# EAGLE design TB67S109ATFG Board 3x - with 40mm fans - Grbl (EAGLE 9.0.0)
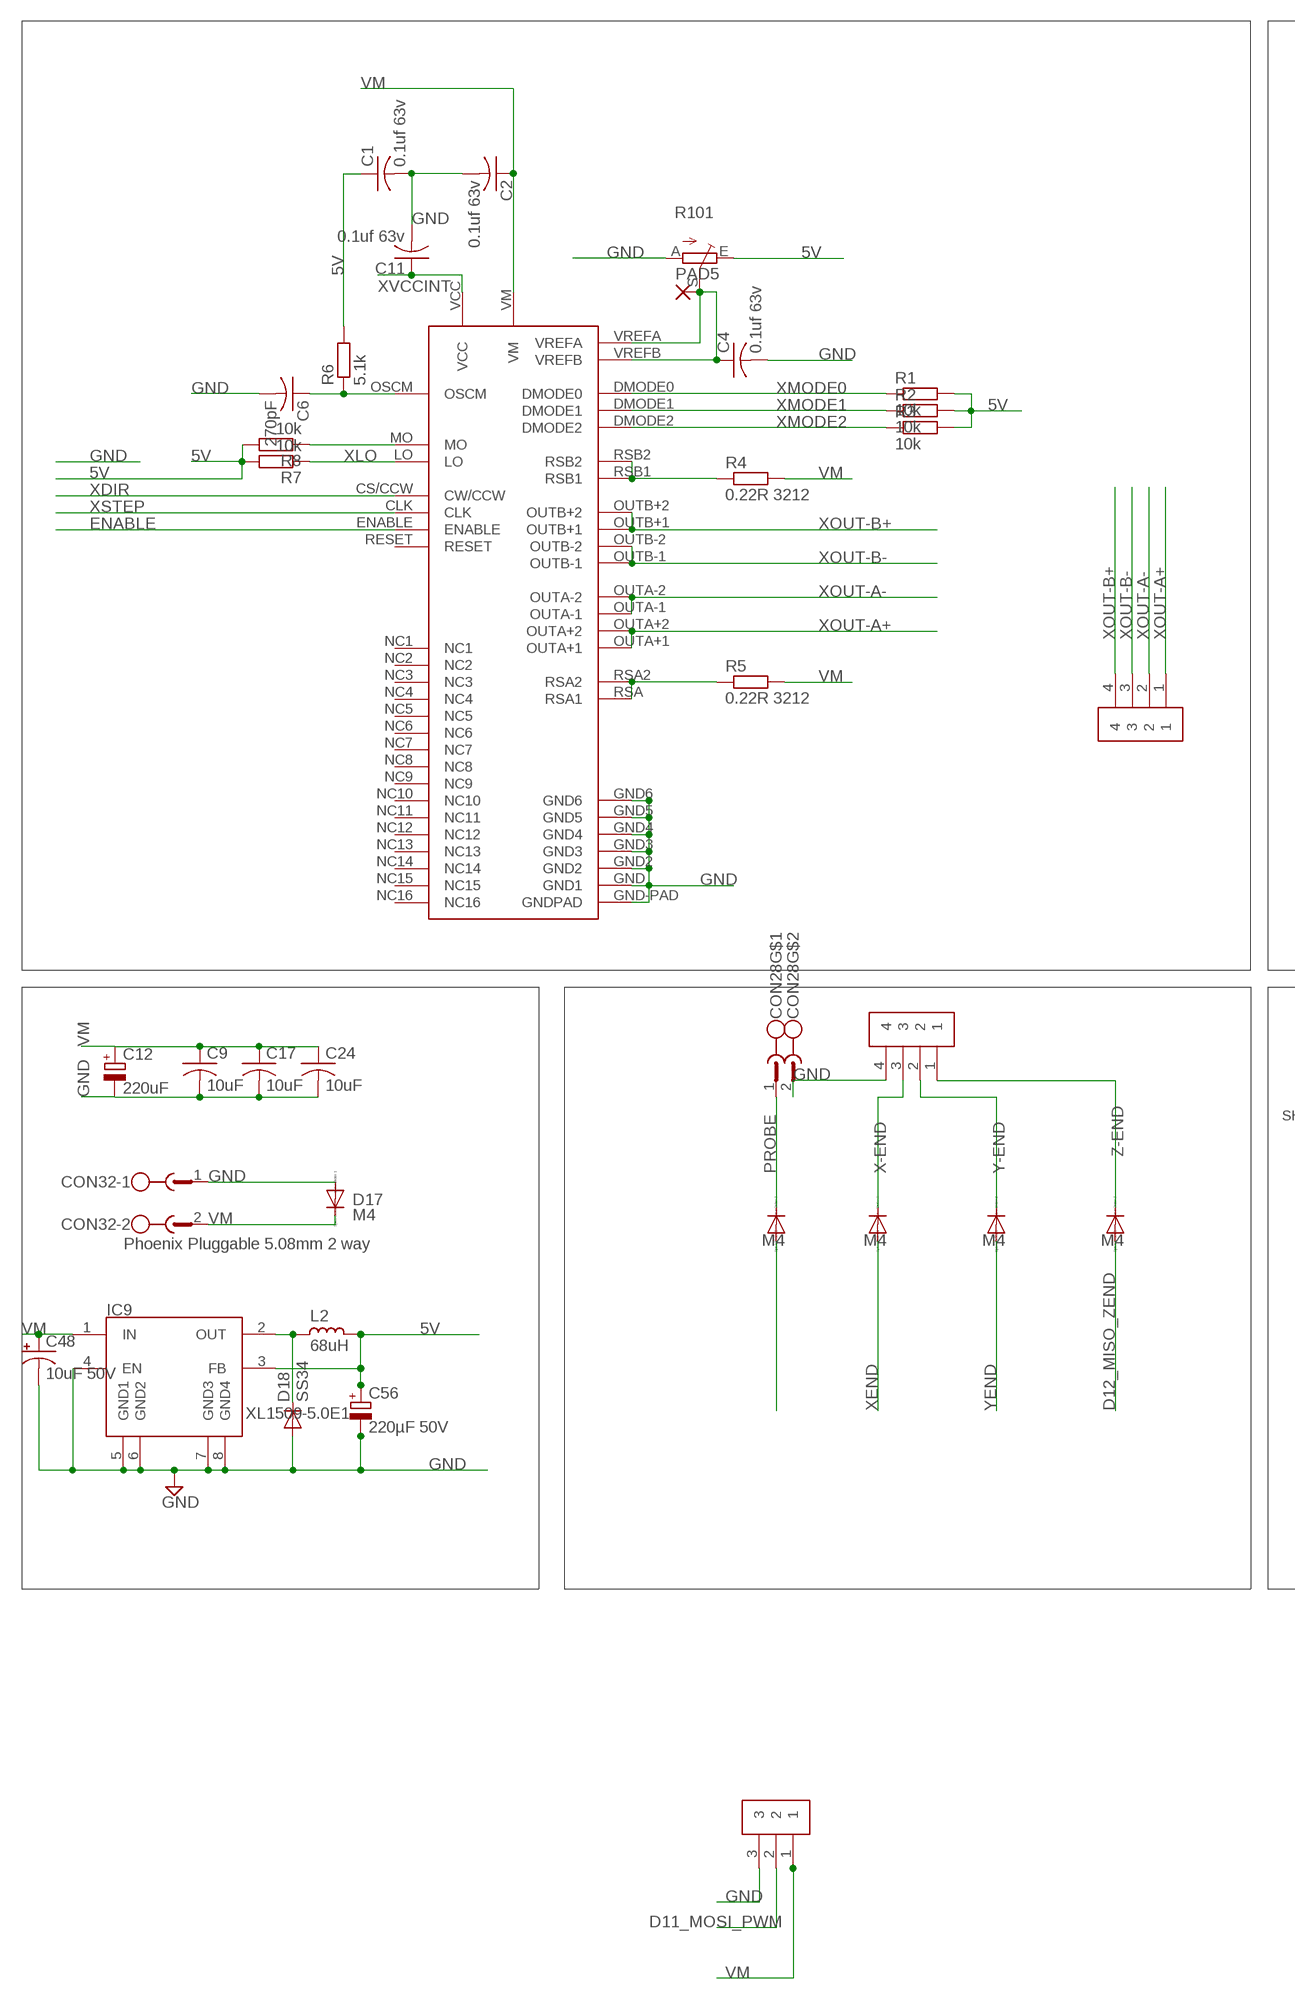
[diagram p0: schematic, sheet 1, part 1 of 2]
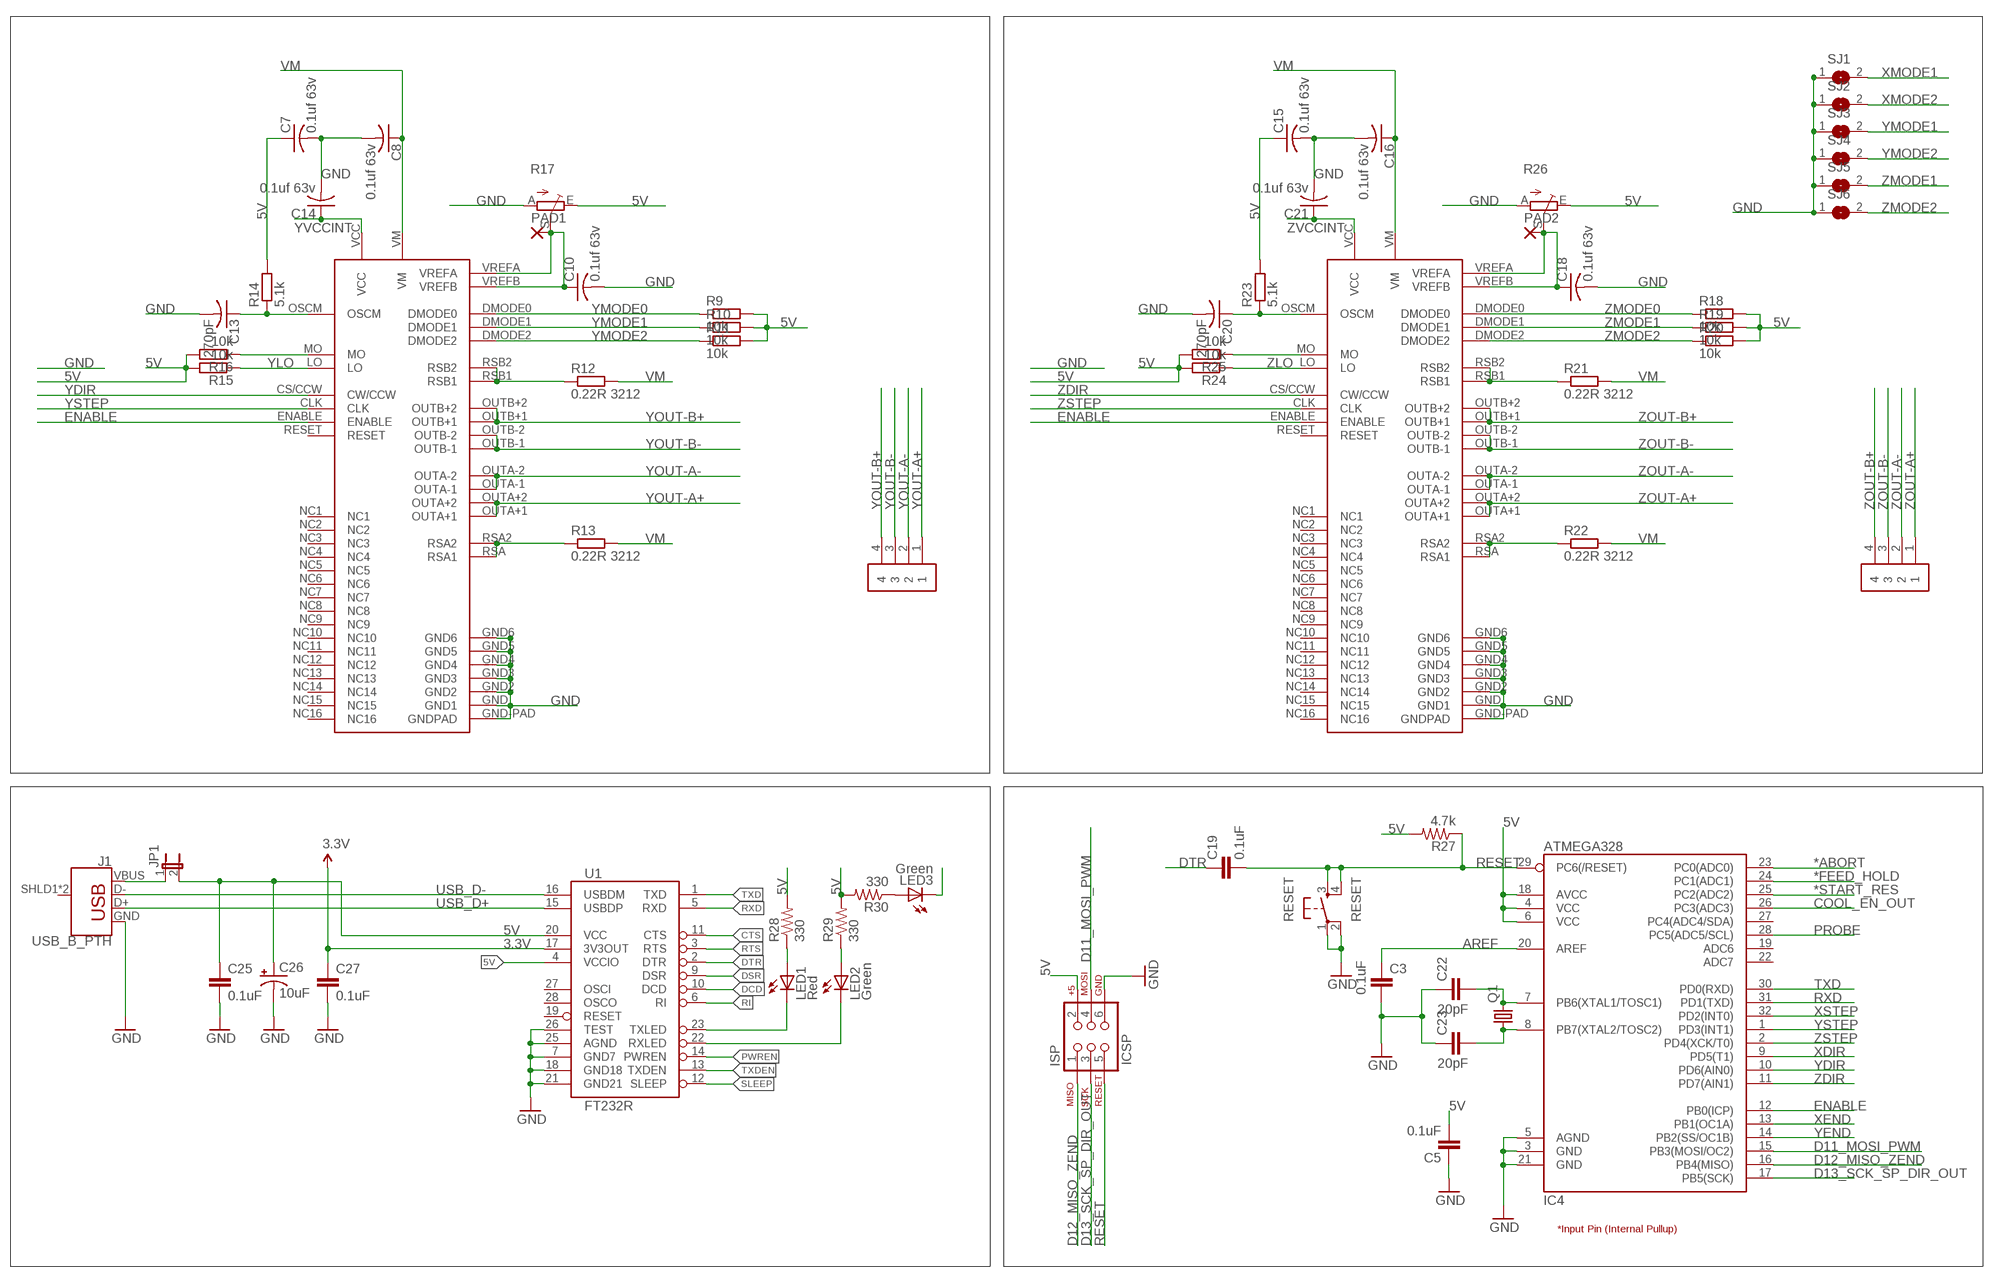
[diagram p1: schematic, sheet 1, part 2 of 2]

## Parts
C1  0.1uf 63v  C-USC0603K  [C0603K]
C2  0.1uf 63v  C-USC0603K  [C0603K]
C3  0.1uF  CAP0603-CAP  [0603-CAP]
C4  0.1uf 63v  C-USC0603K  [C0603K]
C5  0.1uF  CAP0603-CAP  [0603-CAP]
C6  270pF  C-USC0603K  [C0603K]
C7  0.1uf 63v  C-USC0603K  [C0603K]
C8  0.1uf 63v  C-USC0603K  [C0603K]
C9  10uF  C-USC1206K  [C1206K]
C10  0.1uf 63v  C-USC0603K  [C0603K]
C11  0.1uf 63v  C-USC0603K  [C0603K]
C12  220uF  CPOL-EUE3.5-8  [E3,5-8]
C13  270pF  C-USC0603K  [C0603K]
C14  0.1uf 63v  C-USC0603K  [C0603K]
C15  0.1uf 63v  C-USC0603K  [C0603K]
C16  0.1uf 63v  C-USC0603K  [C0603K]
C17  10uF  C-USC1206K  [C1206K]
C18  0.1uf 63v  C-USC0603K  [C0603K]
C19  0.1uF  CAP0603-CAP  [0603-CAP]
C20  270pF  C-USC0603K  [C0603K]
C21  0.1uf 63v  C-USC0603K  [C0603K]
C22  20pF  CAP1206  [1206]
C23  20pF  CAP1206  [1206]
C24  10uF  C-USC1206K  [C1206K]
C25  0.1uF  0.1UF-25V(+80/-20%)(0603)  [0603-CAP]
C26  10uF  10UF-16V-10%(TANT)  [EIA3216]
C27  0.1uF  0.1UF-25V(+80/-20%)(0603)  [0603-CAP]
C48  10uF 50V  CAP_POL1206  [EIA3216]
C56  220µF 50V  CPOL-EUE3.5-8  [E3,5-8]
CON17  Phoenix Pluggable 3.81mm 3 way  CONNECTOR-M3  [3.81MM-3WAY-PLUGGABLE-SCREW]
CON28  Phoenix Pluggable 3.81mm 2 way  MC1.5/2  [MC1.5/2-G-3.81]
CON32  Phoenix Pluggable 5.08mm 2 way  MSTBA2  [MSTBA2]
D2  M4  DIODE-DO-214AC  [DO-214AC]
D14  M4  DIODE-DO-214AC  [DO-214AC]
D15  M4  DIODE-DO-214AC  [DO-214AC]
D16  M4  DIODE-DO-214AC  [DO-214AC]
D17  M4  DIODE-DO-214AC  [DO-214AC]
D18  SS34  DIODE-DO-214AC  [DO-214AC]
IC4  ATMEGA328  ATMEGA168  [TQFP32-08]
IC9  XL1509-5.0E1  XL1509  [SO08]
ISP  ICSP  AVR_SPI_PRG_6PTH  [2X3]
J1  USB_B_PTH  [USB-B-PTH]
JP1  JP1E  [JP1]
L2  68uH  L_CD75  [CD75]
LED1  Red  LED-RED0603  [LED-0603]
LED2  Green  LED-GREEN0603  [LED-0603]
LED3  Green  LED-GREEN0603  [LED-0603]
PAD1  SMD2  [SMD1,27-2,54]
PAD2  SMD2  [SMD1,27-2,54]
PAD5  SMD2  [SMD1,27-2,54]
Q1  CRYSTALHC49S  [HC49/S]
R1  10k  R-EU_R0603  [R0603]
R2  10k  R-EU_R0603  [R0603]
R3  10k  R-EU_R0603  [R0603]
R4  0.22R 3212  R-EU_R1210  [R1210]
R5  0.22R 3212  R-EU_R1210  [R1210]
R6  5.1k  R-EU_R0603  [R0603]
R7  10k  R-EU_R0603  [R0603]
R8  10k  R-EU_R0603  [R0603]
R9  10k  R-EU_R0603  [R0603]
R10  10k  R-EU_R0603  [R0603]
R11  10k  R-EU_R0603  [R0603]
R12  0.22R 3212  R-EU_R1210  [R1210]
R13  0.22R 3212  R-EU_R1210  [R1210]
R14  5.1k  R-EU_R0603  [R0603]
R15  10k  R-EU_R0603  [R0603]
R16  10k  R-EU_R0603  [R0603]
R17  TRIM_EU-B25P  [B25P]
R18  10k  R-EU_R0603  [R0603]
R19  10k  R-EU_R0603  [R0603]
R20  10k  R-EU_R0603  [R0603]
R21  0.22R 3212  R-EU_R1210  [R1210]
R22  0.22R 3212  R-EU_R1210  [R1210]
R23  5.1k  R-EU_R0603  [R0603]
R24  10k  R-EU_R0603  [R0603]
R25  10k  R-EU_R0603  [R0603]
R26  TRIM_EU-B25P  [B25P]
R27  4.7k  R-US_R0603  [R0603]
R28  330  330OHM1/10W1%(0603)  [0603-RES]
R29  330  330OHM1/10W1%(0603)  [0603-RES]
R30  330  330OHM1/10W1%(0603)  [0603-RES]
R101  TRIM_EU-B25P  [B25P]
RESET  RESET  TAC_SWITCHPTH  [TACTILE-PTH]
SJ1  SJ  [SJ]
SJ2  SJ  [SJ]
SJ3  SJ  [SJ]
SJ4  SJ  [SJ]
SJ5  SJ  [SJ]
SJ6  SJ  [SJ]
U1  FT232R  FT232RLSSOP  [SSOP28DB]
U$1  TB67S109AFTG  [TB67S109AFTG-HTSSPO48-P-300-0.50]
U$2  CONNECTOR-M4  [3.81MM-4WAY-PLUGGABLE-SCREW]
U$3  CONNECTOR-M4  [3.81MM-4WAY-PLUGGABLE-SCREW]
U$4  TB67S109AFTG  [TB67S109AFTG-HTSSPO48-P-300-0.50]
U$5  CONNECTOR-M4  [3.81MM-4WAY-PLUGGABLE-SCREW]
U$7  CONNECTOR-M4  [3.81MM-4WAY-PLUGGABLE-SCREW]
U$17  TB67S109AFTG  [TB67S109AFTG-HTSSPO48-P-300-0.50]

## Nets
3.3V [power]: C27.1 U1.17(3V3OUT)
5V: C1.1 C5.2 C7.1 C15.1 C25.1 C26.A(+) C56.+ IC4.4(VCC) IC4.6(VCC) IC4.18(AVCC) IC9.3(FB) ISP.2 JP1.2 L2.1 R1.2 R2.2 R3.2 R6.2 R7.2 R8.2 R9.2 R10.2 R11.2 R14.2 R15.2 R16.2 R17.E R18.2 R19.2 R20.2 R23.2 R24.2 R25.2 R26.E R27.2 R28.2 R29.2 R30.2 R101.E U1.4(VCCIO) U1.20(VCC)
*ABORT: IC4.23(PC0(ADC0))
*FEED_HOLD: IC4.24(PC1(ADC1))
*START_RES: IC4.25(PC2(ADC2))
AREF: C3.1 IC4.20(AREF)
COOL_EN_OUT: IC4.26(PC3(ADC3))
CTS: U1.11(CTS)
D11_MOSI_PWM: CON17.2 IC4.15(PB3(MOSI/OC2)) ISP.4
D12_MISO_ZEND: D16.A IC4.16(PB4(MISO)) ISP.1
D13_SCK_SP_DIR_OUT: IC4.17(PB5(SCK)) ISP.3
DCD: U1.10(DCD)
DSR: U1.9(DSR)
DTR: C19.1 U1.2(DTR)
ENABLE: IC4.12(PB0(ICP)) U$1.ENABLE U$4.ENABLE U$17.ENABLE
GND: C1.2 C2.2 C3.2 C4.2 C5.1 C6.2 C7.2 C8.2 C9.2 C10.2 C11.2 C12.- C13.2 C14.2 C15.2 C16.2 C17.2 C18.2 C20.2 C21.2 C22.1 C23.1 C24.2 C25.2 C26.C(-) C27.2 C48.C(-) C56.- CON17.3 CON28.2 CON32.1 D17.A D18.2(A) IC4.3(GND) IC4.5(AGND) IC4.21(GND) IC9.4(EN) IC9.5(GND1) IC9.6(GND2) IC9.7(GND3) IC9.8(GND4) ISP.6 J1.GND LED3.C R17.A R26.A R101.A RESET.1 RESET.2 SJ1.1 SJ2.1 SJ3.1 SJ4.1 SJ5.1 SJ6.1 U1.7(GND7) U1.18(GND18) U1.21(GND21) U1.25(AGND) U1.26(TEST) U$1.GND2 U$1.GND3 U$1.GND4 U$1.GND5 U$1.GND6 U$1.GND(GND1) U$1.GND-PAD(GNDPAD) U$4.GND2 U$4.GND3 U$4.GND4 U$4.GND5 U$4.GND6 U$4.GND(GND1) U$4.GND-PAD(GNDPAD) U$7.4 U$17.GND2 U$17.GND3 U$17.GND4 U$17.GND5 U$17.GND6 U$17.GND(GND1) U$17.GND-PAD(GNDPAD)
N$1: LED1.A R28.1
N$2: LED2.A R29.1
N$3: J1.VBUS JP1.1
N$4: D18.1(C) IC9.2(OUT) L2.2
N$5: LED3.A R30.1
N$25: C22.2 IC4.7(PB6(XTAL1/TOSC1)) Q1.2
N$26: C23.2 IC4.8(PB7(XTAL2/TOSC2)) Q1.1
P0W: C4.1 PAD5.1(P) R101.S U$17.VREFA U$17.VREFB
P0W1: C10.1 PAD1.1(P) R17.S U$1.VREFA U$1.VREFB
P0W2: C18.1 PAD2.1(P) R26.S U$4.VREFA U$4.VREFB
PROBE: D2.A IC4.28(PC5(ADC5/SCL))
PROBE-IN: CON28.1 D2.C
PWREN: U1.14(PWREN)
RESET: C19.2 IC4.29(PC6(/RESET)) ISP.5 R27.1 RESET.3 RESET.4
RI: U1.6(RI)
RTS: U1.3(RTS)
RXD: IC4.31(PD1(TXD)) U1.5(RXD)
RXLED: LED2.C U1.22(RXLED)
SLEEP: U1.12(SLEEP)
TXD: IC4.30(PD0(RXD)) U1.1(TXD)
TXDEN: U1.13(TXDEN)
TXLED: LED1.C U1.23(TXLED)
USB_D+: J1.D+ U1.15(USBDP)
USB_D-: J1.D- U1.16(USBDM)
VM: C2.1 C8.1 C9.1 C12.+ C16.1 C17.1 C24.1 C48.A(+) CON17.1 CON32.2 D17.C IC9.1(IN) R4.2 R5.2 R12.2 R13.2 R21.2 R22.2 U$1.VM U$4.VM U$17.VM
X-END: D14.C U$7.3
XDIR: IC4.9(PD5(T1)) U$17.CS/CCW(CW/CCW)
XEND: D14.A IC4.13(PB1(OC1A))
XLO: R7.1 U$17.LO
XMO: R8.1 U$17.MO
XMO1: R16.1 U$1.MO
XMO2: R25.1 U$4.MO
XMODE0: R1.1 U$17.DMODE0
XMODE1: R2.1 SJ1.2 U$17.DMODE1
XMODE2: R3.1 SJ2.2 U$17.DMODE2
XOSCM: C6.1 R6.1 U$17.OSCM
XOSCM1: C13.1 R14.1 U$1.OSCM
XOSCM2: C20.1 R23.1 U$4.OSCM
XOUT-A+: U$2.1 U$17.OUTA+1 U$17.OUTA+2
XOUT-A-: U$2.2 U$17.OUTA-1 U$17.OUTA-2
XOUT-B+: U$2.4 U$17.OUTB+1 U$17.OUTB+2
XOUT-B-: U$2.3 U$17.OUTB-1 U$17.OUTB-2
XRSA: R5.1 U$17.RSA2 U$17.RSA(RSA1)
XRSA1: R13.1 U$1.RSA2 U$1.RSA(RSA1)
XRSA2: R22.1 U$4.RSA2 U$4.RSA(RSA1)
XRSB: R4.1 U$17.RSB1 U$17.RSB2
XRSB1: R12.1 U$1.RSB1 U$1.RSB2
XRSB2: R21.1 U$4.RSB1 U$4.RSB2
XSTEP: IC4.32(PD2(INT0)) U$17.CLK
XVCCINT: C11.1 U$17.VCC
Y-END: D15.C U$7.2
YDIR: IC4.10(PD6(AIN0)) U$1.CS/CCW(CW/CCW)
YEND: D15.A IC4.14(PB2(SS/OC1B))
YLO: R15.1 U$1.LO
YMODE0: R9.1 U$1.DMODE0
YMODE1: R10.1 SJ3.2 U$1.DMODE1
YMODE2: R11.1 SJ4.2 U$1.DMODE2
YOUT-A+: U$1.OUTA+1 U$1.OUTA+2 U$3.1
YOUT-A-: U$1.OUTA-1 U$1.OUTA-2 U$3.2
YOUT-B+: U$1.OUTB+1 U$1.OUTB+2 U$3.4
YOUT-B-: U$1.OUTB-1 U$1.OUTB-2 U$3.3
YSTEP: IC4.1(PD3(INT1)) U$1.CLK
YVCCINT: C14.1 U$1.VCC
Z-END: D16.C U$7.1
ZDIR: IC4.11(PD7(AIN1)) U$4.CS/CCW(CW/CCW)
ZLO: R24.1 U$4.LO
ZMODE0: R18.1 U$4.DMODE0
ZMODE1: R19.1 SJ5.2 U$4.DMODE1
ZMODE2: R20.1 SJ6.2 U$4.DMODE2
ZOUT-A+: U$4.OUTA+1 U$4.OUTA+2 U$5.1
ZOUT-A-: U$4.OUTA-1 U$4.OUTA-2 U$5.2
ZOUT-B+: U$4.OUTB+1 U$4.OUTB+2 U$5.4
ZOUT-B-: U$4.OUTB-1 U$4.OUTB-2 U$5.3
ZSTEP: IC4.2(PD4(XCK/T0)) U$4.CLK
ZVCCINT: C21.1 U$4.VCC
Unconnected: IC4.19(ADC6) IC4.22(ADC7) IC4.27(PC4(ADC4/SDA)) J1.SHLD1(SHIELD) J1.SHLD2(SHIELD) U1.19(RESET) U1.27(OSCI) U1.28(OSCO) U$1.NC1 U$1.NC2 U$1.NC3 U$1.NC4 U$1.NC5 U$1.NC6 U$1.NC7 U$1.NC8 U$1.NC9 U$1.NC10 U$1.NC11 U$1.NC12 U$1.NC13 U$1.NC14 U$1.NC15 U$1.NC16 U$1.RESET U$4.NC1 U$4.NC2 U$4.NC3 U$4.NC4 U$4.NC5 U$4.NC6 U$4.NC7 U$4.NC8 U$4.NC9 U$4.NC10 U$4.NC11 U$4.NC12 U$4.NC13 U$4.NC14 U$4.NC15 U$4.NC16 U$4.RESET U$17.NC1 U$17.NC2 U$17.NC3 U$17.NC4 U$17.NC5 U$17.NC6 U$17.NC7 U$17.NC8 U$17.NC9 U$17.NC10 U$17.NC11 U$17.NC12 U$17.NC13 U$17.NC14 U$17.NC15 U$17.NC16 U$17.RESET

## Notes on the sheet
- *Input Pin (Internal Pullup)

## Library data of the parts
C1 C2 C4 C6-C8 C10 C11 C13-C16 C18 C20 C21 = rcl:C-US: CAPACITOR, American symbol
C3 C5 C19 C22 C23 = SparkFun:CAP: Capacitor Standard 0603 ceramic capacitor, and 0.1" leaded capacitor.
C9 C17 C24 = adafruit:C-US: CAPACITOR, American symbol
C12 = resistor:CPOL-EU: POLARIZED CAPACITOR, European symbol
C25 C27 = SparkFun-Capacitors:0.1UF-25V(+80/-20%)(0603): CAP-00810 Ceramic Standard decoupling cap; PROD_ID: CAP-00810
C26 = SparkFun-Capacitors:10UF-16V-10%(TANT): CAP-00811 1206/EIA-3216 Tantalum capacitor; PROD_ID: CAP-00811
C48 = SparkFun:CAP_POL: Capacitor Polarized These are standard SMD and PTH capacitors. Normally 10uF, 47uF, and 100uF in electrolytic and tantalum varieties. Always verify the external diameter of the through hole cap, it varies with capacity, voltage, and manufacturer. The EIA devices should be standard.
C56 = rcl:CPOL-EU: POLARIZED CAPACITOR, European symbol
CON17 = openbuilds-eagle-library:CONNECTOR-M3
CON28 = jt-con-phoenix-3.81:MC1.5/2
CON32 = con-phoenix-508:MSTBA2: PHOENIX; MF: FARNELL; MPN: 1757242; OC_FARNELL: 3705171; OC_NEWARK: 71C4161
D2 D14-D17 = diode:DIODE-: DIODE
D18 = dp_devices:DIODE: Various Diode Packages
IC4 = SparkFun:ATMEGA168
IC9 = Cohesion_parts:XL1509
ISP = SparkFun:AVR_SPI_PRG_6: AVR ISP 6 Pin This is the reduced ISP connector for AVR programming. Common on Arduino. This footprint will take up less PCB space and can be used with a 10-pin to 6-pin adapter such as SKU: BOB-08508
J1 = SparkFun-Connectors:USB_B: USB Type B Connector SparkFun Products: SparkFun Stepoko <https://www.sparkfun.com/products/13899> PTH; PROD_ID: CONN-08278; SF_ID: PRT-00139
JP1 = jumper:JP1E: JUMPER
L2 = rc-master-smd:L_: INDUCTOR
LED1 = SparkFun-LED:LED-RED: Assorted Red LEDs LilyPad 1206- DIO-09912 1206- DIO-00809 0603- DIO-00819; PROD_ID: DIO-00819; VALUE: RED
LED2 LED3 = SparkFun-LED:LED-GREEN: Various green LEDs 0603- DIO-00821 LARGE- DIO-00862 LILYPAD- DIO-09910; PROD_ID: DIO-00821; VALUE: GREEN
PAD1 PAD2 PAD5 = wirepad:SMD2: SMD PAD
Q1 = adafruit:CRYSTAL: CRYSTAL; OC_FARNELL: 1667008; OC_NEWARK: unknown
R1-R16 R18-R25 = resistor:R-EU_: RESISTOR, European symbol
R17 R26 R101 = pot:TRIM_EU-: POTENTIOMETER
R27 = rcl:R-US_: RESISTOR, American symbol
R28-R30 = SparkFun-Resistors:330OHM1/10W1%(0603): RES-00818; PROD_ID: RES-00818
RESET = SparkFun:TAC_SWITCH: Momentary Switch Button commonly used for reset or general input. Spark Fun Electronics SKU : COM-00097
SJ1-SJ6 = jumper:SJ: SMD solder JUMPER
U1 = SparkFun:FT232RL: USB UART FT232RL 4th Generation USB UART (USB <-> Serial) Controller. Spark Fun Electronics SKU : COM-00650
U$1 U$4 U$17 = TB67S109AFTG:TB67S109AFTG
U$2 U$3 U$5 U$7 = openbuilds-eagle-library:CONNECTOR-M4

## Net classes
0 default: width 0.152 mm, clearance 0.152 mm
1 power: width 0.152 mm, clearance 0.152 mm
2 small signal: width 0.152 mm, clearance 0.152 mm

## Board
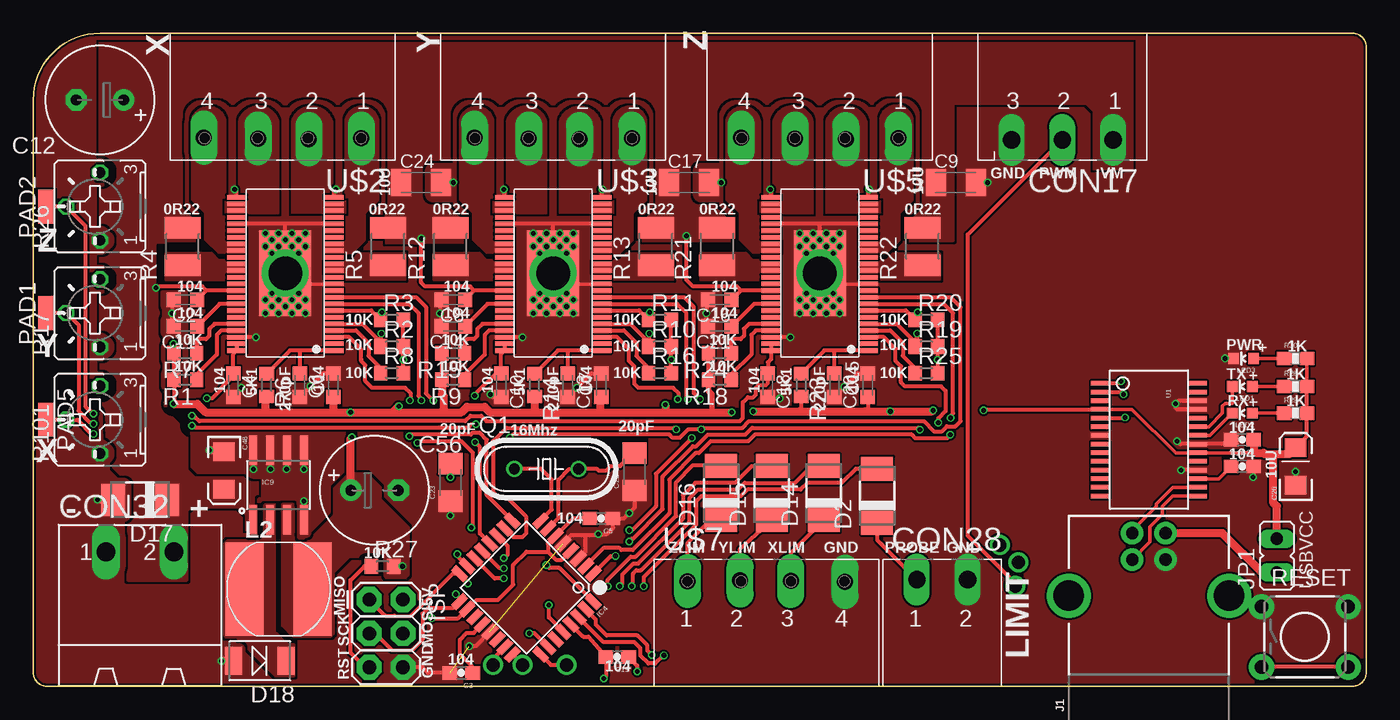
[diagram p2: board, top side]
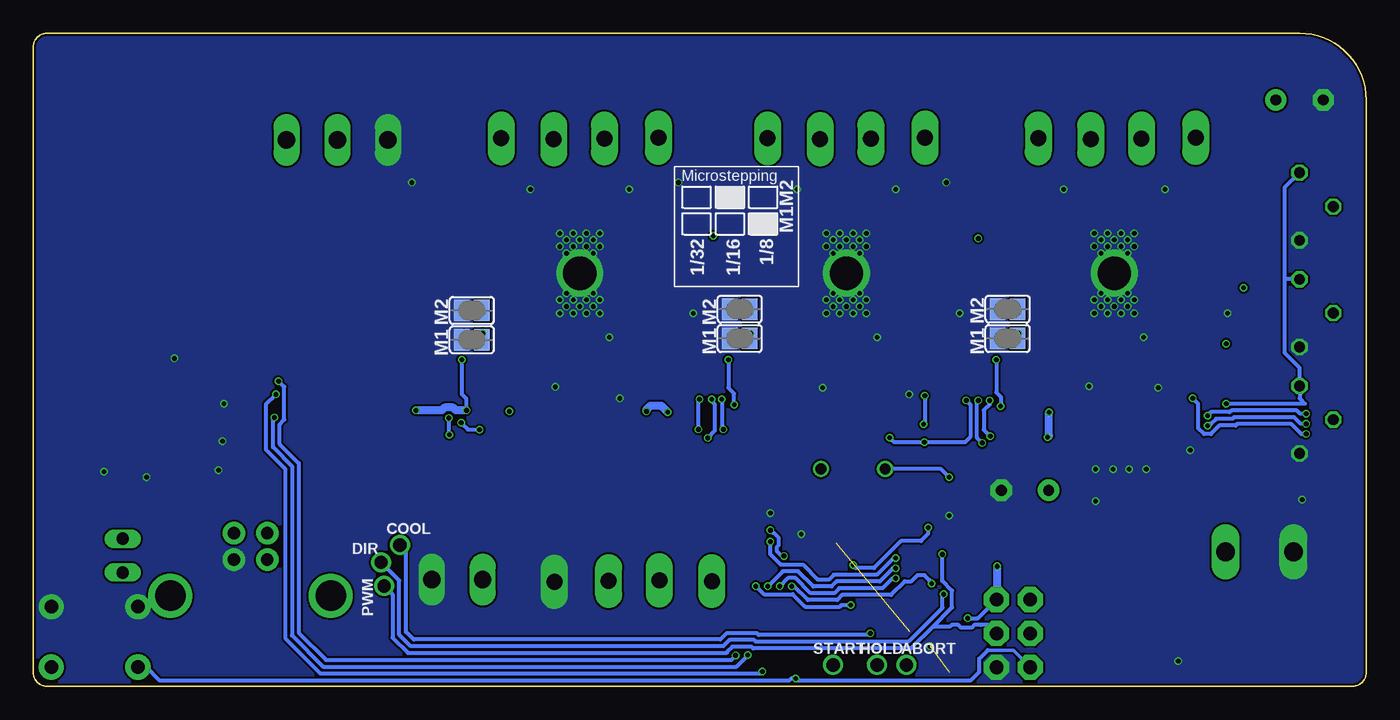
[diagram p3: board, bottom side, seen from below]

Size 100 x 49 mm. Coordinates in mm from the lower left corner, seen from the top.
Outline: 0,1 0,44 arc-90 5,49 99,49 arc-90 100,48 100,1 arc-90 99,0 1,0 arc-90 0,1
Copper layers (1*16): Top 0.035mm / dielectric 0.2mm / Bottom 0.035mm
Design rules "SeeedStudio_4layer_DRU_no_angle_20140221 *": minimum track width 6mil, minimum drill 12mil, track to track 6mil, track to pad 6mil, pad to pad 6mil, via to via 6mil, smd to smd 0mil, copper to edge 6mil, drill to drill 6mil, minimum pad ring 6mil, minimum via ring 4mil, stop-mask expansion 4mil, vias tented up to drill 25mil, thermal gap 10mil

### Footprints (pad centres in the part's own frame; a part is rotated, then mirrored left to right if it is on the bottom)
C0603K = smd 1.05 x 1.08: 1 -0.875,0; 2 0.875,0
0603-CAP = smd 1.1 x 1: 1 -0.85,0; 2 0.85,0
C1206K = smd 1.5 x 2: 1 -1.5,0; 2 1.5,0
E3,5-8 = drill 0.813 pad 1.6: + -1.778,0 | drill 0.813 pad 1.6 octagon: - 1.778,0
1206 = smd 1.6 x 1.8: 1 -1.4,0; 2 1.4,0
EIA3216 = smd 1.4 x 1.6: A 1.4,0; C -1.4,0
3.81MM-3WAY-PLUGGABLE-SCREW = drill 1.3 long: 1 -3.81,8; 2 0,8; 3 3.81,8
MC1.5/2-G-3.81 = drill 1.3 long: 1 -3.81,8; 2 0,8
MSTBA2 = drill 1.397 long: 1 -2.54,5.08; 2 2.54,5.08
DO-214AC = smd 1.8 x 2.4: A 2.025,0; C -2.025,0
DO-214AC' = smd 1.27 x 2.1: 1 -1.98,0; 2 1.98,0
TQFP32-08 = smd 1.27 x 0.559: 1 -4.293,2.8; 2 -4.293,2; 3 -4.293,1.2; 4 -4.293,0.4; 5 -4.293,-0.4; 6 -4.293,-1.2; 7 -4.293,-2; 8 -4.293,-2.8; 17 4.293,-2.8; 18 4.293,-2; 19 4.293,-1.2; 20 4.293,-0.4; 21 4.293,0.4; 22 4.293,1.2; 23 4.293,2; 24 4.293,2.8 | smd 0.559 x 1.27: 9 -2.8,-4.293; 10 -2,-4.293; 11 -1.2,-4.293; 12 -0.4,-4.293; 13 0.4,-4.293; 14 1.2,-4.293; 15 2,-4.293; 16 2.8,-4.293; 25 2.8,4.293; 26 2,4.293; 27 1.2,4.293; 28 0.4,4.293; 29 -0.4,4.293; 30 -1.2,4.293; 31 -2,4.293; 32 -2.8,4.293
SO08 = smd 0.61 x 2.21: 1 -1.905,-2.616; 2 -0.635,-2.616; 3 0.635,-2.616; 4 1.905,-2.616; 5 1.905,2.616; 6 0.635,2.616; 7 -0.635,2.616; 8 -1.905,2.616
2X3 = drill 1.016 pad 1.88 octagon: 1 0,0; 2 0,2.54; 3 2.54,0; 4 2.54,2.54; 5 5.08,0; 6 5.08,2.54
USB-B-PTH = drill 0.914 pad 1.676: D+ 4,1.25; D- 5.981,1.25; GND 4,-1.25; VBUS 5.981,-1.25 | drill 2.286: SHLD1 1.282,-6.02; SHLD2 1.282,6.02
JP1 = drill 0.914 long: 1 0,-1.27; 2 0,1.27
CD75 = smd 7 x 2.85: 1 0,2.54; 2 0,-2.54
LED-0603 = smd 0.8 x 0.8: A 0,-0.75; C 0,0.75
SMD1,27-2,54 = smd 1.27 x 2.54: 1 0,0
HC49/S = drill 0.813: 1 -2.413,0; 2 2.413,0
R0603 = smd 1 x 1.1: 1 -0.85,0; 2 0.85,0
R1210 = smd 1.6 x 2.7: 1 -1.4,0; 2 1.4,0
B25P = drill 0.813 octagon: A -2.54,0; E 2.54,0; S 0,2.54
0603-RES = smd 1.1 x 1: 1 -0.85,0; 2 0.85,0
TACTILE-PTH = drill 1.016 pad 1.88: 1 -3.251,2.261; 2 3.251,2.261; 3 -3.251,-2.261; 4 3.251,-2.261
SJ = smd 1.168 x 1.6: 1 -0.762,0; 2 0.762,0
SSOP28DB = smd 0.348 x 1.397: 1 -4.225,-3.656; 2 -3.575,-3.656; 3 -2.925,-3.656; 4 -2.275,-3.656; 5 -1.625,-3.656; 6 -0.975,-3.656; 7 -0.325,-3.656; 8 0.325,-3.656; 9 0.975,-3.656; 10 1.625,-3.656; 11 2.275,-3.656; 12 2.925,-3.656; 13 3.575,-3.656; 14 4.225,-3.656; 15 4.225,3.656; 16 3.575,3.656; 17 2.925,3.656; 18 2.275,3.656; 19 1.625,3.656; 20 0.975,3.656; 21 0.325,3.656; 22 -0.325,3.656; 23 -0.975,3.656; 24 -1.625,3.656; 25 -2.275,3.656; 26 -2.925,3.656; 27 -3.575,3.656; 28 -4.225,3.656
TB67S109AFTG-HTSSPO48-P-300-0.50 = smd 1.45 x 0.35: CLK -3.65,2.3; CS/CCW -3.65,4.8; DMODE0 3.65,4.3; DMODE1 -3.65,3.8; DMODE2 -3.65,2.8; ENABLE -3.65,1.8; GND -3.65,0.8; GND2 -3.65,-3.7; GND3 -3.65,-5.7; GND4 3.65,-5.7; GND5 3.65,-3.7; GND6 3.65,4.8; LO 3.65,3.8; MO -3.65,4.3; NC1 -3.65,5.3; NC2 -3.65,3.3; NC3 -3.65,0.3; NC4 -3.65,-1.2; NC5 -3.65,-2.7; NC6 -3.65,-3.2; NC7 -3.65,-4.2; NC8 3.65,-4.2; NC9 3.65,-3.2; NC10 3.65,-2.7; NC11 3.65,-1.2; NC12 3.65,0.3; NC13 3.65,0.8; NC14 3.65,1.8; NC15 3.65,2.8; NC16 3.65,3.3; OSCM -3.65,5.8; OUTA+1 -3.65,-1.7; OUTA+2 -3.65,-2.2; OUTA-1 -3.65,-4.7; OUTA-2 -3.65,-5.2; OUTB+1 3.65,-2.2; OUTB+2 3.65,-1.7; OUTB-1 3.65,-5.2; OUTB-2 3.65,-4.7; RESET -3.65,1.3; RSA -3.65,-0.2; RSA2 -3.65,-0.7; RSB1 3.65,-0.7; RSB2 3.65,-0.2; VCC 3.65,2.3; VM 3.65,1.3; VREFA 3.65,5.8; VREFB 3.65,5.3 | smd 3.9 x 6.4: GND-PAD 0,0
3.81MM-4WAY-PLUGGABLE-SCREW = drill 1.2 pad 2.032 long: 1 5.905,-7.874; 2 1.968,-7.945; 3 -1.841,-7.889; 4 -5.905,-7.833

### Placement (x,y rotation side)
C1  22.5,22.6 90 top
C2  11.4,29 180 top
C3  32.1,1 180 top
C4  15,22.6 270 top
C5  42.6,12.6 180 top
C6  20,22.6 270 top
C7  42.6,22.6 90 top
C8  31.5,29 180 top
C9  69.2,37.8 0 top
C10  35.1,22.6 270 top
C11  11.4,27 180 top
C12  5,44 180 top
C13  40.1,22.6 270 top
C14  31.5,27 180 top
C15  62.6,22.6 90 top
C16  51.5,29 180 top
C17  49.2,37.8 0 top
C18  55.1,22.6 270 top
C19  43.8,2.2 180 top
C20  60.1,22.6 270 top
C21  51.5,27 180 top
C22  45.1,16.1 90 top
C23  31.3,15.3 90 top
C24  29.1,37.8 0 top
C25  90.7,18.5 180 top
C26  94.7,16.5 90 top
C27  90.7,16.5 0 top
C48  14.3,16.2 270 top
C56  25.6,14.7 0 top
CON17  77.2,49 180 top
CON28  70.1,0 0 top
CON32  8,5 0 top
D2  63.3,14.3 90 top
D14  59.3,14.5 90 top
D15  55.4,14.5 90 top
D16  51.6,14.5 90 top
D17  8,14 180 top
D18  SS34  [DO-214AC']  17,1.9 180 top
IC4  37,7.4 225 top
IC9  18.4,15.1 0 top
ISP  25.2,6.5 270 top
J1  83.7,5.5 90 top
JP1  93.3,9.8 0 top
L2  18.4,7.3 270 top
LED1  90.7,22.5 90 top
LED2  90.7,20.5 90 top
LED3  90.8,24.6 90 top
PAD1  1,28 0 top
PAD2  1,36 0 top
PAD5  1,20 180 top
Q1  38.5,16.3 0 top
R1  11.4,23 180 top
R2  26.9,25.5 0 top
R3  26.9,27.5 0 top
R4  11.2,33 90 top
R5  26.6,33 90 top
R6  17.5,22.6 270 top
R7  11.4,25 180 top
R8  26.9,23.5 0 top
R9  31.5,23 180 top
R10  47,25.5 0 top
R11  47,27.5 0 top
R12  31.3,33 90 top
R13  46.7,33 90 top
R14  37.6,22.6 270 top
R15  31.5,25 180 top
R16  47,23.5 0 top
R17  5,28 90 top
R18  51.5,23 180 top
R19  67,25.5 0 top
R20  67,27.5 0 top
R21  51.3,33 90 top
R22  66.7,33 90 top
R23  57.6,22.6 270 top
R24  51.5,25 180 top
R25  67,23.5 0 top
R26  5,36 90 top
R27  26.2,9 0 top
R28  94.7,22.5 0 top
R29  94.7,20.5 0 top
R30  94.7,24.6 0 top
R101  5,20 90 top
RESET  95.4,3.7 0 top
SJ1  26.9,26.1 0 bottom
SJ2  26.9,28.3 0 bottom
SJ3  47,26.1 0 bottom
SJ4  47,28.3 0 bottom
SJ5  67.1,26 0 bottom
SJ6  67.1,28.2 0 bottom
U1  83.7,18.5 270 top
U$1  39,31 180 top
U$2  18.7,49 0 top
U$3  39,49 0 top
U$4  59,31 180 top
U$5  59,49 0 top
U$7  55,0 180 top
U$17  18.9,31 180 top

### Tracks (layer width: path | path; a pad name or v marks a point on that pad's centre or on a via)
3.3V
  Top 0.254: U1.17 88.92,15.57 C27.1
5V  (via drill 0.35)
  Top 0.254: v10.5,25.7 10.55,25.65 R7.2 | U1.20 87.7,17.52 | 91.7,17.52 87.7,17.52 | U1.4 82.42,20.77 85.7,17.5 87.67,17.5 87.7,17.52 | R28.2 R30.2
  Top 0.305: R18.2 R24.2 | R16.2 v47.85,24.5 R10.2 R11.2 | R9.2 R15.2 | R8.2 v27.75,24.5 R2.2 R3.2 | R25.2 v67.85,24.5 R19.2 R20.2 | R7.2 R1.2 10.55,21.25 v10.5,21.2 | 41.75,12.84 C5.2 40.5,12.6 IC4.6 38.6,10.7 38.6,10.1 | v27.7,9 R27.2 | 38.6,10.1 39.2,9.5 39.67,9.5 IC4.4 | v29.9,5.1 31.87,5.1 IC4.18 33.24,6.47 34.86,6.47 36,7.61 36,9.1 37,10.1 38.6,10.1 | 27.4,21 v27.42,21.02 | C15.1 62.6,20.82 62.4,20.62 | R23.2 57.6,20.62 57.5,20.62 | C26.A 95.55,18.75 R29.2 R28.2 | v71.3,20.7 71.38,20.77 U1.4
  Top 0.406: R18.2 50.65,22.15 50.9,21.9 50.9,20.56
  Top 0.61: 50.65,22.95 R18.2 | C56.+ 23.82,18.62 v23.9,18.7 | v10.5,21.2 12.3,21.2 12.94,20.56 17.4,20.56 | 17.4,20.56 22.5,20.56 | C1.1 22.5,20.56 | R6.2 17.4,21.65 17.4,20.56 | 26.96,20.56 27.4,21 | 22.5,20.56 v23.8,20.56 26.96,20.56 | 26.96,20.56 30.6,20.56 | 30.6,20.56 32.13,20.56 32.53,20.96 33.87,20.96 34.27,20.56 37.6,20.56 | R9.2 30.65,21.9 30.79,21.77 30.79,20.75 30.6,20.56 | 37.6,20.56 42.5,20.56 | C7.1 42.5,21.62 42.5,20.56 | R14.2 37.6,20.56 | 42.5,20.56 47.3,20.56 | 47.3,20.56 50.9,20.56 v52.4,20.56 | v47.42,21.12 47.42,20.68 47.3,20.56 | v67.5,20.7 67.42,20.62 v64.3,20.62 62.4,20.62 57.5,20.62 v54,20.62 | JP1.2 93.3,13.5 93,13.8 93,17.43 | C25.1 91.55,17.68 91.7,17.52 91.72,17.51 92.31,17.51 92.39,17.43 93,17.43 | 93,17.43 94.22,17.43 C26.A
  Bottom 0.254: 10.45,25.75 v10.5,25.7
  Bottom 0.305: v67.85,24.5 67.85,21.91 67.5,21.56 v67.5,20.7 | v47.85,24.5 47.85,22.4 47.42,21.97 v47.42,21.12 | 6.1,30.5 6.1,25 5,23.9 R101.E 5,21.6 4.6,21.2 v10.5,21.2 | 6.1,30.5 6.1,37.44 R26.E | R17.E 6.06,30.54 6.1,30.5 | 27.7,6.54 ISP.2 29.14,5.1 v29.9,5.1 | v27.42,21.02 27.4,21.03 27.4,21.7 27.75,22.05 v27.75,24.5
  Bottom 0.61: v27.7,9 27.7,6.54 | v23.9,18.7 23.8,18.8 v23.8,20.56 | v52.4,20.56 52.88,21.04 53.72,21.04 54,20.75 v54,20.62 | v67.5,20.7 68.28,20.7 68.5,20.92 69.15,20.92 69.37,20.7 v71.3,20.7
  pour Top (isolate 0.406, rank 2, no thermals): 18.7,13.6 18.7,4.6 19.5,3.8 22.3,3.8 22.5,4 22.5,8.6 23.7,9.8 26,9.8 26.2,9.6 26.2,8.5 26.5,8.2 27.9,8.2 28.1,8.4 28.1,11.9 26,14 26,14.9 25,15.9 23.7,15.9 22.6,14.8 22.6,12.8 20.5,10.7 19.7,10.7 19.5,10.9 19.5,13.6
*ABORT  (via drill 1)
  Top 0.305: IC4.23 34.49,2.06 v34.49,1.59
*FEED_HOLD  (via drill 1)
  Top 0.305: IC4.24 36.7,1.63 v36.7,1.6
*START_RES  (via drill 1)
  Top 0.305: IC4.25 38.84,1.6 v40,1.6
AREF
  Top 0.305: C3.1 32.95,1.45 32,2.4 32,3.5 32.5,4 33.03,4 IC4.20
COOL_EN_OUT  (via drill 0.35, 1)
  Top 0.305: IC4.26 37.6,3.97 v37.2,3.97
  Bottom 0.305: v37.2,3.97 37.2,3.9 37.25,3.85 45.59,3.85 45.72,3.98 47.98,3.98 48.45,3.5 71.47,3.5 72.03,4.07 72.03,10.13 v72.5,10.6
D11_MOSI_PWM  (via drill 0.35, 1)
  Top 0.305: IC4.15 31.8,9.77 v31.8,9.9 | CON17.2 70.1,33.9 70.1,11.3 73.68,7.72 v73.68,7.52
  Bottom 0.305: ISP.4 28.38,4.6 28.92,4.6 28.93,4.59 29.41,4.59 29.6,4.4 30.4,4.4 30.6,4.6 31.11,4.59 31.24,4.47 32.5,4.47 | 32.5,4.47 34.14,2.83 46.01,2.83 46.14,2.96 47.56,2.96 47.95,2.58 47.95,2.54 48,2.49 71.89,2.49 73.05,3.65 73.05,6.88 v73.68,7.52 | v31.8,9.9 31.8,7.89 31.07,7.16 31.07,5.9 32.5,4.47
D12_MISO_ZEND  (via drill 0.35)
  Top 0.254: 27.1,5.3 27.14,5.3 27.21,5.23 28.27,5.23 28.34,5.3 28.4,5.3
  Top 0.305: IC4.16 31.95,8.46 | ISP.1 26.4,5.3 27.1,5.3 | 31.95,8.46 32.6,7.8 v32.6,7.7 | 28.34,5.3 31.49,8.46 31.95,8.46 | v43.09,7.5 43.09,7.99 44.82,9.72 45.17,9.72 48.22,12.77 48.22,15.3 49.51,16.59 51.23,16.59 D16.A
  Bottom 0.305: v32.6,7.7 32.77,7.87 32.77,7.96 33.14,8.33 33.66,8.33 34.12,7.88 34.61,7.88 35.64,6.85 39.31,6.85 39.69,6.48 41.89,6.48 42.91,7.5 v43.09,7.5
D13_SCK_SP_DIR_OUT  (via drill 0.35, 1)
  Top 0.254: 26.9,2.7 27.2,2.7 27.21,2.69 28.27,2.69 28.28,2.7 28.4,2.7
  Top 0.305: ISP.3 25.64,3.96 26.9,2.7 | 28.4,2.7 29.2,3.5 29.2,5.45 29.65,5.9 31.54,5.9 IC4.17 31.98,6.62 v31.7,6.9
  Bottom 0.305: v31.7,6.9 31.79,6.81 31.79,5.9 34.35,3.34 45.8,3.34 45.93,3.47 47.77,3.47 48.24,3 71.68,3 72.54,3.86 72.54,7.94 v73.9,9.3
DTR  (via drill 0.35)
  Top 0.305: U1.2 81.62,22.07 v81.8,21.9 | C19.1 45.3,1.55 v45.3,1.09
  Bottom 0.305: v81.8,21.9 82.53,21.17 82.53,17.73 81.1,16.3 81.1,3.6 78.46,0.96 45.42,0.96 v45.3,1.09
ENABLE  (via drill 0.35)
  Top 0.305: U$17.ENABLE 28.7,29.2 29.46,28.44 29.46,21.98 v30,21.44 | U$1.ENABLE 48.8,29.2 49.56,28.44 49.56,22 v50.02,21.54 | U$4.ENABLE 68.8,29.2 69.56,28.44 69.56,19.88 69.18,19.5 68.54,19.5 68.17,19.14 67.56,19.14 66.81,19.89 53.71,19.89 53.21,19.39 50.22,19.39 v50.1,19.27 49.12,19.27 48.49,18.64 47.96,18.64 47.72,18.88 35.98,18.88 v35.74,18.65 | IC4.12 33.5,11.47 33.5,17.96 v33.14,18.31
  Bottom 0.305: v50.1,19.27 50.1,21.46 v50.02,21.54 | 30,21.39 v30,21.44 29.7,21.14 29.7,18.7 30.09,18.31 v33.14,18.31 35.41,18.31 v35.74,18.65
GND  (via drill 0.35, 2.5)  (2 unrouted)
  Top 0.254: U$4.GND6 v56.8,26.2 | U$1.GND6 v36.7,26.2 | U$17.GND6 v16.7,26.2 | U$17.GND 20.6,30.2 v19.9,29.5 | U$1.GND 40.7,30.2 v40,29.5 | U$4.GND 60.7,30.2 v60,29.5 | LED3.C v89.4,24.6
  Top 0.305: C11.2 10.4,27.12 v10.4,28 10.4,28.88 C2.2 | C14.2 30.62,27.88 v30.5,28 30.5,28.88 C8.2 | C21.2 50.5,27.12 v50.5,28 50.5,28.88 C16.2 | U$1.GND3 42.65,37.25 v42.7,37.3 | U$1.GND4 35.35,37.25 v35.3,37.3 | U$4.GND3 62.65,37.25 v62.7,37.3 | U$4.GND4 55.35,37.25 v55.3,37.3 | U$17.GND3 22.55,37.15 v22.7,37.3 | U$17.GND4 15.25,37.15 v15.1,37.3 | U$17.GND2 18.9,34.7 | 18.9,34.7 U$17.GND5 | U$1.GND2 39,34.7 | 39,34.7 U$1.GND5 | U$4.GND2 58.9,34.7 | 58.9,34.7 U$4.GND5 | U$4.GND-PAD 59,34.6 58.9,34.7 | U$1.GND-PAD 39,34.7 | U$17.GND-PAD 18.9,34.7 | C9.2 v71.6,37.8 | C17.2 v51.6,37.8 | C24.2 v31.5,37.8 | C20.2 v60.84,22.46 61.85,23.48 C15.2 | C13.2 v40.79,22.41 41.85,23.48 C7.2 | C6.2 v20.79,22.51 21.75,23.48 C1.2 | C4.2 15,21.82 v15.6,22.4 | v34.3,21.9 34.42,21.73 C10.2 | IC4.5 40.38,11.34 41.4,11.34 | 41.4,11.34 42.32,11.34 v42.39,11.41 43.01,11.41 43.5,11.9 43.5,12.6 C5.1 44.3,12.6 v44.7,13 45.1,13.4 C22.1 | 41.4,11.34 41.4,10.1 IC4.3 | IC4.21 33.17,3 v32.7,3 | IC9.6 19.04,16.34 v19,16.3 | IC9.5 v20.3,16.3 | IC9.7 17.77,16.34 v17.8,16.3 | IC9.8 v16.5,16.3 | IC9.4 v20.3,13.89 v20.3,13.9 | C18.2 55.52,21.6 v56,21.6 | C23.1 v31.3,12.8 | C3.2 29.6,1 29.18,1.42 ISP.6 | C25.2 89.53,18.18 U1.21 86.03,18.18 v85.8,18.4 | C26.C v94.7,16.1 | C27.2 91.55,15.75 v91.5,15.7 | U1.25 85.83,20.77 85.7,20.9 v85.7,21.2 85.92,21.43 U1.26 | U1.18 86.12,16.23 v86.1,16.2
  Top 0.61: C48.C 14.2,17.7 v13.2,17.7 | D17.A v4.8,14 | D18.2 v14.1,1.9
  other vias: 59,31 39,31 18.9,31 59.5,33 58.5,33 58,32.5 58,33.5 59,33.5 60,33.5 60,32.5 58,29.5 58.5,29 59.5,29 60,28.5 59,28.5 58,28.5 39.5,29 38,29.5 38.5,29 38,28.5 39,28.5 40,28.5 40,32.5 38,32.5 38.5,33 39.5,33 39,33.5 40,33.5 38,33.5 19.4,33 18.4,33 18.9,33.5 17.9,32.5 17.9,33.5 19.9,33.5 19.9,32.5 17.9,29.5 18.4,29 19.4,29 19.9,28.5 18.9,28.5 17.9,28.5 59.5,28 58.5,28 57.5,28 57.5,29 60.5,29 60.5,28 60.5,33 60.5,34 59.5,34 58.5,34 57.5,34 57.5,33 40.5,33 40.5,34 39.5,34 38.5,34 37.5,34 37.5,33 40.5,29 40.5,28 39.5,28 38.5,28 37.5,28 37.5,29 20.4,33 20.4,34 19.4,34 18.4,34 17.4,34 17.4,33 17.4,29 17.4,28 18.4,28 19.4,28 20.4,28 20.4,29
  pour Bottom (rank 6, no thermals): 0,50.4 99.5,50.4 101,48.9 101,0.1 100,-0.9 -0.1,-0.9 -1.2,0.2 -1.2,49.2
  pour Top (rank 6, no thermals): 0.5,49.8 100,49.8 101.5,48.3 101.5,-0.5 100.5,-1.5 0.4,-1.5 -0.7,-0.4 -0.7,48.6
N$1
  Top 0.254: LED1.A R28.1
N$2
  Top 0.254: LED2.A R29.1
N$3
  Top 0.61: JP1.1 92.17,8.53 89.22,11.48 J1.VBUS
N$4
  pour Top (isolate 0.406, rank 3, no thermals): 18.2,13.6 18.2,4.4 19.4,3.2 19.5,3.1 19.5,0.8 18.2,0.8 15.3,3.7 14.5,3.7 14.4,3.8 14.4,10.7 14.6,10.9 17,10.9 17.4,11.3 17.4,13.6
N$5
  Top 0.254: R30.1 LED3.A
N$25
  Top 0.305: Q1.2 42.3,16.3 42.44,16.17 42.96,16.17 43.31,16.52 44.02,16.52 45,17.5 C22.2 | Q1.2 | IC4.7 39.4,12.63 39.4,15.5 40.2,16.3 Q1.2
N$26  (via drill 0.35)
  Top 0.305: IC4.8 38.89,13.25 38.89,15.51 38.1,16.3 Q1.1 | C23.2 v31.3,15.7
  Bottom 0.305: v31.3,15.7 31.9,16.3 Q1.1
P0W  (via drill 0.35)
  Top 0.305: U$17.VREFB U$17.VREFA 15,24.95 C4.1 15,23.29 14.1,22.4 14.1,22.27 13.44,21.6 v13.01,21.6 | PAD5.1 R101.S 3.33,20 3.87,19.46 3.87,19.43 4.36,18.93 v4.5,18.93
  Bottom 0.305: v4.5,18.93 4.87,18.93 5.61,19.68 9.69,19.68 9.82,19.55 11,19.55 11.64,18.92 12.16,18.92 12.6,19.36 12.6,21.19 v13.01,21.6
P0W1  (via drill 0.35)
  Top 0.305: U$1.VREFB U$1.VREFA 35.1,24.95 C10.1 34.71,23.48 33.11,21.88 v33.11,21.8 | v33.2,19.67 32.89,19.67 32.61,19.39 12.19,19.39 12.16,19.43 12.02,19.43 v11.9,19.55 | PAD1.1 R17.S 2.5,28 3.39,27.11 3.39,20.66 4.24,19.81 4.38,19.81 v4.5,19.69
  Bottom 0.305: v33.11,21.8 33.11,19.76 v33.2,19.67 | v4.5,19.69 4.91,19.69 5.4,20.18 9.9,20.18 10.03,20.06 11.25,20.06 11.64,19.67 11.78,19.67 v11.9,19.55
P0W2  (via drill 0.35)
  Top 0.305: U$4.VREFB U$4.VREFA 55.35,24.55 55.1,24.3 C18.1 55.1,22.77 54.93,22.61 54.41,22.61 54.2,22.4 54.2,21.88 54,21.67 53.61,21.67 53.24,21.3 53.24,20.3 53.24,20.14 53,19.9 34,19.9 33.6,20.3 32.8,20.3 32.4,19.9 12.44,19.9 12.16,20.18 12.02,20.18 v11.9,20.31 | PAD2.1 R26.S 3.9,34.56 3.9,21.01 4.34,20.57 4.38,20.57 v4.5,20.44
  Bottom 0.305: v4.5,20.44 4.94,20.44 5.19,20.69 10.11,20.69 10.24,20.57 11.64,20.57 v11.9,20.31
PROBE  (via drill 0.35)
  Top 0.305: v38.68,6.09 38.68,5.16 IC4.28 | v45.8,7.5 45.8,8.19 49.75,12.14 49.75,13.9 50.1,14.25 53.07,14.25 53.58,14.76 57.56,14.76 58.07,15.27 60.65,15.27 61.7,16.32 D2.A
  Bottom 0.305: v45.8,7.5 45.2,6.9 43.04,6.9 42.1,5.97 39.48,5.97 39.35,6.09 v38.68,6.09
PROBE-IN
  Top 0.305: CON28.1 63.65,10.64 63.6,10.69 63.3,10.99 D2.C
RESET  (via drill 0.35)
  Top 0.305: ISP.5 24.88,1.42 23.8,2.5 23.8,7.95 24.85,9 R27.1 | C19.2 42.95,2.3 42.67,2.3 | C19.2 42.95,0.73 v42.8,0.58 | C19.2 41.64,3.71 41.26,3.71 IC4.29 | RESET.4 RESET.3
  Bottom 0.254: ISP.5 26.48,2.7 27.2,2.7 27.21,2.69 28.27,2.69 28.28,2.7 28.4,2.7
  Bottom 0.305: 28.4,2.7 29.04,2.06 29.04,1.06 29.64,0.46 42.8,0.46 v42.8,0.58 | v42.8,0.58 42.92,0.7 | v42.8,0.58 43.12,0.58 43.24,0.46 90.56,0.46 91.54,1.44 RESET.3
RXD  (via drill 0.35)
  Top 0.305: U1.5 81.86,20.12 v81.9,20.17 | IC4.31 41.45,5.75 42.21,4.99 42.21,4.61 43.01,3.81 45.31,3.81 46.06,3.06 46.06,2.67 v46.4,2.33
  Bottom 0.305: v81.9,20.17 82.02,20.04 82.02,17.94 80.59,16.51 80.59,3.81 78.25,1.47 47.26,1.47 v46.4,2.33
RXLED
  Top 0.254: U1.22 88.28,18.82 LED2.C
TXD  (via drill 0.35)
  Top 0.305: v81.6,22.9 81.42,22.73 U1.1 | IC4.30 42.8,3.3 45.1,3.3 45.56,2.85 45.56,2.28 46.14,1.7 46.66,1.7 47.27,2.31 v47.31,2.31
  Bottom 0.305: v81.6,22.9 81.17,22.47 81.17,20.01 81.52,19.66 81.52,18.15 80.08,16.72 80.08,4.02 78.04,1.98 47.62,1.98 47.31,2.29 v47.31,2.31
TXLED
  Top 0.254: U1.23 88.19,19.48 89.22,20.5 89.22,21.04 89.41,21.23 89.95,21.23 LED1.C
USB_D+
  Top 0.254: J1.D+ 83.78,10.83 83.78,11.96 84.7,12.88 84.7,13.5 85.47,14.28 U1.15
USB_D-
  Top 0.254: J1.D- 82.45,11.71 84.24,13.5 84.24,13.69 85.48,14.93 U1.16
VM  (via drill 0.35)
  Top 0.305: U$4.VM 53.08,29.7 | 53.08,29.7 C16.1 | U$1.VM 33.08,29.7 | 33.08,29.7 C8.1 | U$17.VM 12.97,29.7 | 12.97,29.7 C2.1 | 12.97,29.7 12.68,30 9.3,30 v9.2,29.9 | 33.08,29.7 32.77,30 29.4,30 29.1,30.3 v29.1,33.6 | 53.08,29.7 52.77,30 49.5,30 49,30.5 v49,33.8
  pour Top (isolate 0.61, rank 4, no thermals): 11.5,8 11.5,13.2 11.8,13.5 15.4,13.5 16,12.9 16,11.3 16.8,11.3 16.8,15.4 16.6,15.6 12.1,15.6 11.5,16.2 11.5,19 9.5,21 9.5,33 10,33.5 12.5,33.5 12.5,35 11.5,36 11.5,39.5 26.5,39.5 26.5,33.3 32.6,33.3 32.6,35.1 31.5,36.2 31.5,39.5 46.5,39.5 46.5,36.3 45.4,35.2 45.4,33.5 52.5,33.5 52.5,35.3 51.4,36.4 51.4,39.5 66.7,39.5 66.7,36.4 65.5,35.2 65.5,33.5 69,33.5 69,43.8 79,43.8 79.6,43.2 79.6,38.8 79.7,38.9 82.4,38.9 82.4,48.3 82.2,48.5 5,48.5 5,46.5 5.1,17.4 7.2,15.3 7.1,8
X-END
  Top 0.305: U$7.3 56.84,10.02 D14.C
XDIR  (via drill 0.35)
  Top 0.305: U$17.CS/CCW 23.7,26.2 24.4,25.5 24.4,25.48 24.59,25.3 24.59,24.55 24.6,24.54 24.6,24.4 24.9,24.1 24.9,22.9 25.4,22.4 27.9,22.4 28.34,21.96 28.34,21.53 v28.25,21.44 | IC4.9 34.01,14.35 34.01,18.49 33.5,19 32.94,19 32.82,18.88 28.32,18.88 v28.2,18.76
  Bottom 0.305: 28.25,18.81 v28.2,18.76 28.68,19.24 28.68,20.72 28.25,21.15 v28.25,21.44
XEND  (via drill 0.35)
  Top 0.305: v35.3,8.85 34.99,8.85 IC4.13 | v44.9,7.5 45,7.6 45,8.46 45.24,8.7 45.59,8.7 49.24,12.35 49.24,14.12 49.88,14.76 52.86,14.76 53.37,15.27 57.15,15.27 58.4,16.52 D14.A
  Bottom 0.305: v44.9,7.5 v44.89,7.5 43.76,8.63 42.62,8.63 41.47,7.49 40.11,7.49 39.73,7.86 36.5,7.86 35.51,8.85 v35.3,8.85
XLO
  Top 0.305: U$17.LO 13.6,27.2 13.21,26.81 13.21,26.29 12.97,26.05 12.45,26.05 12.25,25.85 R7.1
XMO
  Top 0.305: U$17.MO 24.2,26.7 25.14,25.76 25.14,24.78 26.05,23.88 R8.1
XMO1
  Top 0.305: U$1.MO 44.3,26.7 45.24,25.76 45.24,24.78 46.15,23.88 R16.1
XMO2
  Top 0.305: U$4.MO 64.3,26.7 65.24,25.76 65.24,24.78 66.15,23.88 R25.1
XMODE0
  Top 0.305: U$17.DMODE0 14.1,26.7 13.77,26.36 13.77,24.89 12.25,23.38 R1.1
XMODE1  (via drill 0.35)
  Top 0.305: U$17.DMODE1 24.7,27.2 26.05,25.85 R2.1 26.05,26.42 v26.1,26.47
  Bottom 0.305: SJ1.2 26.14,26.43 v26.1,26.47
XMODE2  (via drill 0.35)
  Top 0.305: U$17.DMODE2 25.35,28.2 25.98,27.57 | 25.98,27.57 R3.1 | v26.14,28.07 25.98,27.91 25.98,27.57
  Bottom 0.305: SJ2.2 v26.14,28.07
XOSCM
  Top 0.305: U$17.OSCM 20,25.2 | 20,25.2 19.25,25.2 R6.1 | C6.1 20,25.2
XOSCM1
  Top 0.305: U$1.OSCM 40.1,25.2 | 40.1,25.2 39.35,25.2 R14.1 | C13.1 40.1,25.2
XOSCM2
  Top 0.305: U$4.OSCM 60,25.2 | 60,25.2 59.35,25.2 R23.1 | C20.1 60.1,25.1 60,25.2
XOUT-A+
  pour Top (rank 2, no thermals): 21.9,32.5 23.9,32.5 24.9,33.5 24.9,35.5 25.9,36.5 25.9,42.4 arc165 23.4,42.4 23.4,34 22.9,33.5 21.9,33.5
XOUT-A-
  pour Top (no thermals): 23.4,35.5 19.4,35.5 19.4,42.4 arc-148 22.4,42.4 22.4,36.5 23.4,36.5
XOUT-B+
  pour Top (rank 2, no thermals): 15.9,32.5 13.9,32.5 12.9,33.5 12.9,35.5 11.9,36.5 11.9,42.4 arc-165 14.4,42.4 14.4,34 14.9,33.5 15.9,33.5
XOUT-B-
  pour Top (no thermals): 14.4,35.5 18.4,35.5 18.4,42.4 arc146 15.4,42.4 15.4,36.5 14.4,36.5
XRSA
  pour Top (no thermals): 27.9,30.5 21.9,30.5 21.9,32 23.9,32 24.4,32.5 27.9,32.5
XRSA1
  pour Top (no thermals): 48,30.5 42,30.5 42,32 44,32 44.5,32.5 48,32.5
XRSA2
  pour Top (no thermals): 68,30.5 62,30.5 62,32 64,32 64.5,32.5 68,32.5
XRSB
  pour Top (no thermals): 15.9,32 13.9,32 13.4,32.5 9.9,32.5 9.9,30.5 15.9,30.5
XRSB1
  pour Top (no thermals): 36,32 34,32 33.5,32.5 30,32.5 30,30.5 36,30.5
XRSB2
  pour Top (no thermals): 56,32 54,32 53.5,32.5 50,32.5 50,30.5 56,30.5
XSTEP  (via drill 0.35)
  Top 0.305: U$17.CLK 28.2,28.7 28.9,28 28.9,21.8 29.1,21.6 v29.1,21.44 | IC4.32 39.48,8.88 38.7,8.88 v38.5,9.08 | v32.87,11.9 32.99,12.02 32.99,17.51 32.12,18.38 28.92,18.38 v28.8,18.25
  Bottom 0.305: v32.87,11.9 32.87,11.43 33.4,10.9 34.9,10.9 36.92,8.88 38.3,8.88 v38.5,9.08 | v29.1,21.44 29.19,21.35 29.19,18.64 v28.8,18.25
XVCCINT
  Top 0.305: U$17.VCC 13.97,28.7 C11.1
Y-END
  Top 0.305: U$7.2 53.03,10.31 D15.C
YDIR  (via drill 0.35)
  Top 0.305: U$1.CS/CCW 43.8,26.2 44.5,25.5 44.5,25.48 44.69,25.3 44.69,24.41 45.1,24 45.1,22.7 45.4,22.4 48,22.4 48.4,22 48.4,21.59 v48.35,21.54 | v48.23,19.27 48.1,19.39 35.49,19.39 34.52,18.42 34.52,14.56 34.98,14.1 35.6,14.1 37,12.7 37,11.5 36.7,11.2 36.03,11.2 IC4.10
  Bottom 0.305: v48.35,21.54 48.35,19.39 v48.23,19.27
YEND  (via drill 0.35)
  Top 0.305: v35.29,8.09 34.61,8.09 IC4.14 | v44,7.5 44.2,7.7 44.2,8.38 45.03,9.21 45.38,9.21 48.73,12.56 48.73,14.33 49.67,15.27 52.65,15.27 53.9,16.52 D15.A
  Bottom 0.305: 43.99,7.49 v43.99,7.49 v44,7.5 43.37,8.13 42.83,8.13 41.68,6.98 39.9,6.98 39.52,7.36 36.29,7.36 35.55,8.09 v35.29,8.09
YLO
  Top 0.305: U$1.LO 33.7,27.2 33.31,26.81 33.31,26.29 33.07,26.05 32.55,26.05 32.35,25.85 R15.1
YMODE0
  Top 0.305: U$1.DMODE0 34.2,26.7 33.87,26.36 33.87,24.89 32.35,23.38 R9.1
YMODE1  (via drill 0.35)
  Top 0.305: U$1.DMODE1 44.8,27.2 46.15,25.85 R10.1 46.2,25.55 v46.2,26.47
  Bottom 0.305: SJ3.2 46.2,26.14 v46.2,26.47
YMODE2  (via drill 0.35)
  Top 0.305: U$1.DMODE2 45.45,28.2 46.02,27.62 | 46.02,27.62 R11.1 | v46.24,28.07 46.02,27.86 46.02,27.62
  Bottom 0.305: SJ4.2 v46.24,28.07
YOUT-A+
  pour Top (rank 2, no thermals): 42,32.5 44,32.5 45,33.5 45,35.5 46,36.5 46,42.4 arc165 43.5,42.4 43.5,34 43,33.5 42,33.5
YOUT-A-
  pour Top (no thermals): 43.5,35.5 39.5,35.5 39.5,42.4 arc-146 42.5,42.4 42.5,36.5 43.5,36.5
YOUT-B+
  pour Top (rank 2, no thermals): 36,32.5 34,32.5 33,33.5 33,35.5 32,36.5 32,42.4 arc-165 34.5,42.4 34.5,34 35,33.5 36,33.5
YOUT-B-
  pour Top (no thermals): 34.5,35.5 38.5,35.5 38.5,42.4 arc146 35.5,42.4 35.5,36.5 34.5,36.5
YSTEP  (via drill 0.35)
  Top 0.305: U$1.CLK 48.3,28.7 49,28 49,21.65 v49.11,21.54 | IC4.1 43.34,9.78 v43.68,9.78 | v49.4,18.64 46.7,15.94 46.7,13.5 44.9,11.7 v44.7,11.7
  Bottom 0.305: v43.68,9.78 43.86,9.78 44.19,10.11 44.19,10.47 44.07,10.6 44.07,11.12 44.44,11.49 44.49,11.49 v44.7,11.7 | v49.4,18.64 48.86,19.18 48.86,21.15 48.98,21.28 48.98,21.42 v49.11,21.54
YVCCINT
  Top 0.305: U$1.VCC 34.08,28.7 C14.1
Z-END
  Top 0.305: D16.C 50.8,12.47 49.09,10.77 U$7.1
ZDIR  (via drill 0.35)
  Top 0.305: U$4.CS/CCW 63.8,26.2 64.69,25.32 64.69,24.41 65.1,24 65.1,22.8 65.4,22.5 68.1,22.5 68.44,22.16 68.44,20.64 67.9,20.1 v67.9,19.77 | v66.52,19.26 66.39,19.38 53.92,19.38 53.42,18.88 50.61,18.88 49.73,18 49.49,18 47.21,15.72 47.21,13.29 44.99,11.07 44.91,11.07 v44.7,10.86 | v35.3,9.6 35.6,9.9 35.6,10.5 IC4.11
  Bottom 0.305: v67.9,19.77 67.39,19.26 v66.52,19.26 | v44.7,10.86 44.7,9.9 43.94,9.14 42.27,9.14 41.13,8 40.32,8 39.95,8.37 36.71,8.37 35.48,9.6 v35.3,9.6 35.44,9.6
ZLO
  Top 0.305: U$4.LO 53.7,27.2 53.31,26.81 53.31,26.29 53.07,26.05 52.55,26.05 52.35,25.85 R24.1
ZMODE0
  Top 0.305: U$4.DMODE0 54.2,26.7 53.87,26.36 53.87,24.89 52.35,23.38 R18.1
ZMODE1  (via drill 0.35)
  Top 0.305: 65.95,25.7 66.08,25.57 | 66.08,25.57 R19.1 | U$4.DMODE1 64.8,27.2 66.08,25.93 | 66.08,25.93 66.08,25.57 | v66.3,26.47 66.3,26.15 66.08,25.93
  Bottom 0.305: SJ5.2 66.34,26.43 v66.3,26.47
ZMODE2  (via drill 0.35)
  Top 0.305: U$4.DMODE2 65.45,28.2 66.08,27.57 | 66.08,27.57 R20.1 | v66.34,28.07 66.08,27.8 66.08,27.57
  Bottom 0.305: SJ6.2 v66.34,28.07
ZOUT-A+
  pour Top (rank 2, no thermals): 62,32.5 64,32.5 65,33.5 65,35.5 66,36.5 66,42.4 arc174 63.5,42.4 63.5,34 63,33.5 62,33.5
ZOUT-A-
  pour Top (no thermals): 63.5,35.5 59.5,35.5 59.5,42.4 arc-146 62.5,42.4 62.5,36.5 63.5,36.5
ZOUT-B+
  pour Top (rank 2, no thermals): 56,32.5 54,32.5 53,33.5 53,35.5 52,36.5 52,42.4 arc-165 54.5,42.4 54.5,34 55,33.5 56,33.5
ZOUT-B-
  pour Top (no thermals): 54.5,35.5 58.5,35.5 58.5,42.4 arc148 55.5,42.4 55.5,36.5 54.5,36.5
ZSTEP  (via drill 0.35)
  Top 0.305: U$4.CLK 68.3,28.7 69,28 69,20.48 68.83,20.31 v68.83,20.13 | v68.8,18.87 68.56,18.63 66.15,18.63 65.91,18.88 54.13,18.88 53.63,18.38 50.82,18.38 49.94,17.5 49.7,17.5 47.72,15.52 47.72,12.98 44.96,10.22 44.13,10.22 43.94,10.41 42.84,10.41 IC4.2
  Bottom 0.305: v68.8,18.87 68.8,20.11 v68.83,20.13
ZVCCINT
  Top 0.305: U$4.VCC 54.08,28.7 C21.1
(copper drawn outside any net)
  shapes: Bottom area x3

### Text on the board
tPlace: Y | Z | X | GND | PWM | VM | 10U | 10U | 10U | 0R22 | 0R22 | 0R22 | 0R22 | 0R22 | 0R22 | Z | 104 | 104 | 104 | 104 | 104 | 104 | 10K | 10K | 10K | 10K | 10K | 10K | Y | 10K | 10K | 10K | PWR | + | 1K | 10K | 104 | 5K1 | 270pF | 104 | 10K | 104 | 5K1 | 270pF | 104 | 10K | 104 | 5K1 | 270pF | 104 | 10K | 10K | 10K | TX | + | 1K | RX | + | 1K | 20pF | 16Mhz | 20pF | 104 | X | 104 | 10U | 104 | - | + | ZLIM | YLIM | XLIM | GND | PROBE | GND | 10K | USBVCC | 5V | MISO | SCK | MOSI | 104 | 104 | LIMIT | GND | RST
bPlace: Microstepping | M2 | M1 | 1/8 | 1/16 | 1/32 | M2 | M2 | M2 | M1 | M1 | M1 | COOL | DIR | PWM | ABORT | HOLD | START